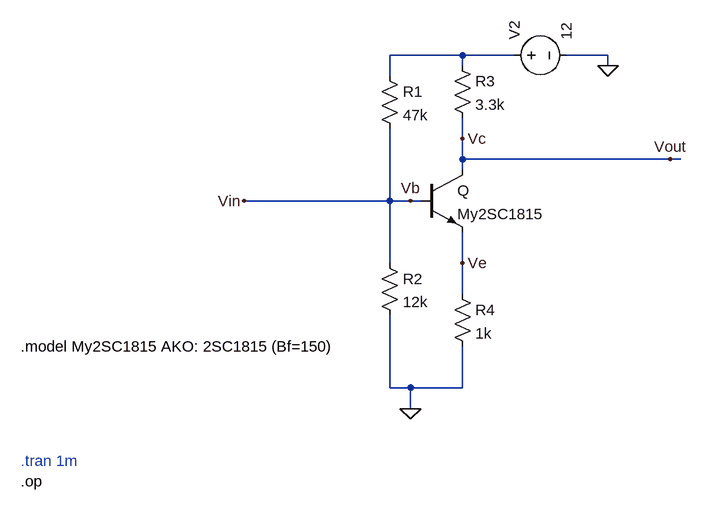
[diagram p0: schematic DC.asc]
DC.asc, the LTspice schematic file:
Version 4.1
SHEET 1 880 696
WIRE 144 -32 32 -32
WIRE 224 -32 144 -32
WIRE 368 -32 304 -32
WIRE 144 -16 144 -32
WIRE 368 -16 368 -32
WIRE 32 0 32 -32
WIRE 144 96 144 64
WIRE 144 128 144 96
WIRE 464 128 144 128
WIRE 480 128 464 128
WIRE 144 144 144 128
WIRE 32 192 32 80
WIRE 32 192 -192 192
WIRE 64 192 32 192
WIRE 80 192 64 192
WIRE 32 288 32 192
WIRE 144 288 144 240
WIRE 144 336 144 288
WIRE 32 480 32 368
WIRE 64 480 32 480
WIRE 144 480 144 416
WIRE 144 480 64 480
WIRE 64 512 64 480
FLAG 64 512 0
FLAG 368 -16 0
FLAG 64 192 Vb
FLAG 464 128 Vout
FLAG -192 192 Vin
FLAG 144 288 Ve
FLAG 144 96 Vc
SYMBOL npn 80 144 R0
SYMATTR InstName Q
SYMATTR Value My2SC1815
SYMBOL res 16 -16 R0
SYMATTR InstName R1
SYMATTR Value 47k
SYMBOL res 128 -32 R0
SYMATTR InstName R3
SYMATTR Value 3.3k
SYMBOL voltage 208 -32 R270
WINDOW 123 0 0 Left 0
WINDOW 39 0 0 Left 0
SYMATTR InstName V2
SYMATTR Value 12
SYMBOL res 128 320 R0
SYMATTR InstName R4
SYMATTR Value 1k
SYMBOL res 16 272 R0
SYMATTR InstName R2
SYMATTR Value 12k
TEXT -536 416 Left 2 !.model My2SC1815 AKO: 2SC1815 (Bf=150)
TEXT -536 592 Left 2 ;.tran 1m
TEXT -536 624 Left 2 !.op

The netlist it stands for:
* DC.asc
Q Vc Vin Ve 0 My2SC1815
R1 N001 Vin 47k
R3 N001 Vc 3.3k
V2 N001 0 12
R4 Ve 0 1k
R2 Vin 0 12k
.model NPN NPN
.model PNP PNP
.lib standard.bjt
.model My2SC1815 AKO: 2SC1815 (Bf=150)
* .tran 1m
.op
.backanno
.end